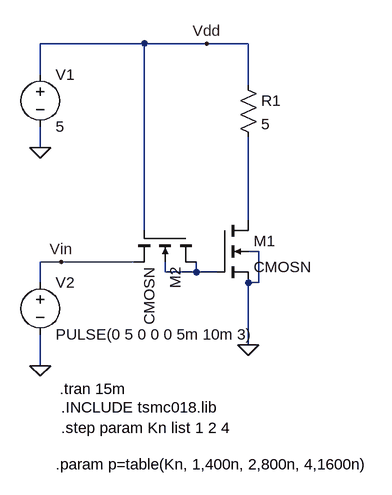
[diagram p0: schematic 1e.asc]
1e.asc, the LTspice schematic file:
Version 4
SHEET 1 880 680
WIRE 32 -320 -128 -320
WIRE 128 -320 32 -320
WIRE 192 -320 128 -320
WIRE -128 -272 -128 -320
WIRE 192 -256 192 -320
WIRE -128 -160 -128 -192
WIRE 192 -48 192 -176
WIRE 32 -32 32 -320
WIRE 208 0 192 0
WIRE -96 16 -128 16
WIRE 16 16 -96 16
WIRE 64 32 64 16
WIRE 112 32 112 16
WIRE 112 32 64 32
WIRE 144 32 112 32
WIRE -128 48 -128 16
WIRE 208 48 208 0
WIRE 208 48 192 48
WIRE 192 144 192 48
WIRE -128 176 -128 128
FLAG -128 176 0
FLAG -128 -160 0
FLAG -96 16 Vin
FLAG 128 -320 Vdd
FLAG 192 144 0
SYMBOL voltage -128 -288 R0
WINDOW 123 0 0 Left 0
WINDOW 39 0 0 Left 0
SYMATTR InstName V1
SYMATTR Value 5
SYMBOL voltage -128 32 R0
WINDOW 123 0 0 Left 0
WINDOW 39 0 0 Left 0
SYMATTR InstName V2
SYMATTR Value PULSE(0 5 0 0 0 5m 10m 3)
SYMBOL res 176 -272 R0
SYMATTR InstName R1
SYMATTR Value 5
SYMBOL cmosn 144 -48 R0
SYMATTR InstName M1
SYMATTR Value2 l=180n w=400n
SYMBOL cmosn 112 -32 R90
SYMATTR InstName M2
SYMATTR Value2 l=180n w={Kn}
TEXT -96 240 Left 2 !.INCLUDE tsmc018.lib
TEXT -96 272 Left 2 !.step param Kn list 1 2 4
TEXT -104 328 Left 2 !.param p=table(Kn, 1,400n, 2,800n, 4,1600n)
TEXT -98 212 Left 2 !.tran 15m

The netlist it stands for:
* 1e.asc
V1 Vdd 0 5
V2 Vin 0 PULSE(0 5 0 0 0 5m 10m 3)
R1 Vdd N001 5
M1 N001 N002 0 0 CMOSN l=180n w=400n
M2 N002 Vdd Vin N002 CMOSN l=180n w={Kn}
.model NMOS NMOS
.model PMOS PMOS
.lib standard.mos
.INCLUDE tsmc018.lib
.step param Kn list 1 2 4
.param p=table(Kn, 1,400n, 2,800n, 4,1600n)
.tran 15m
.backanno
.end